# Altium schematic sheet Robot Omini.SchDoc
size A4; SheetNumber: 1; SheetTotal: 1
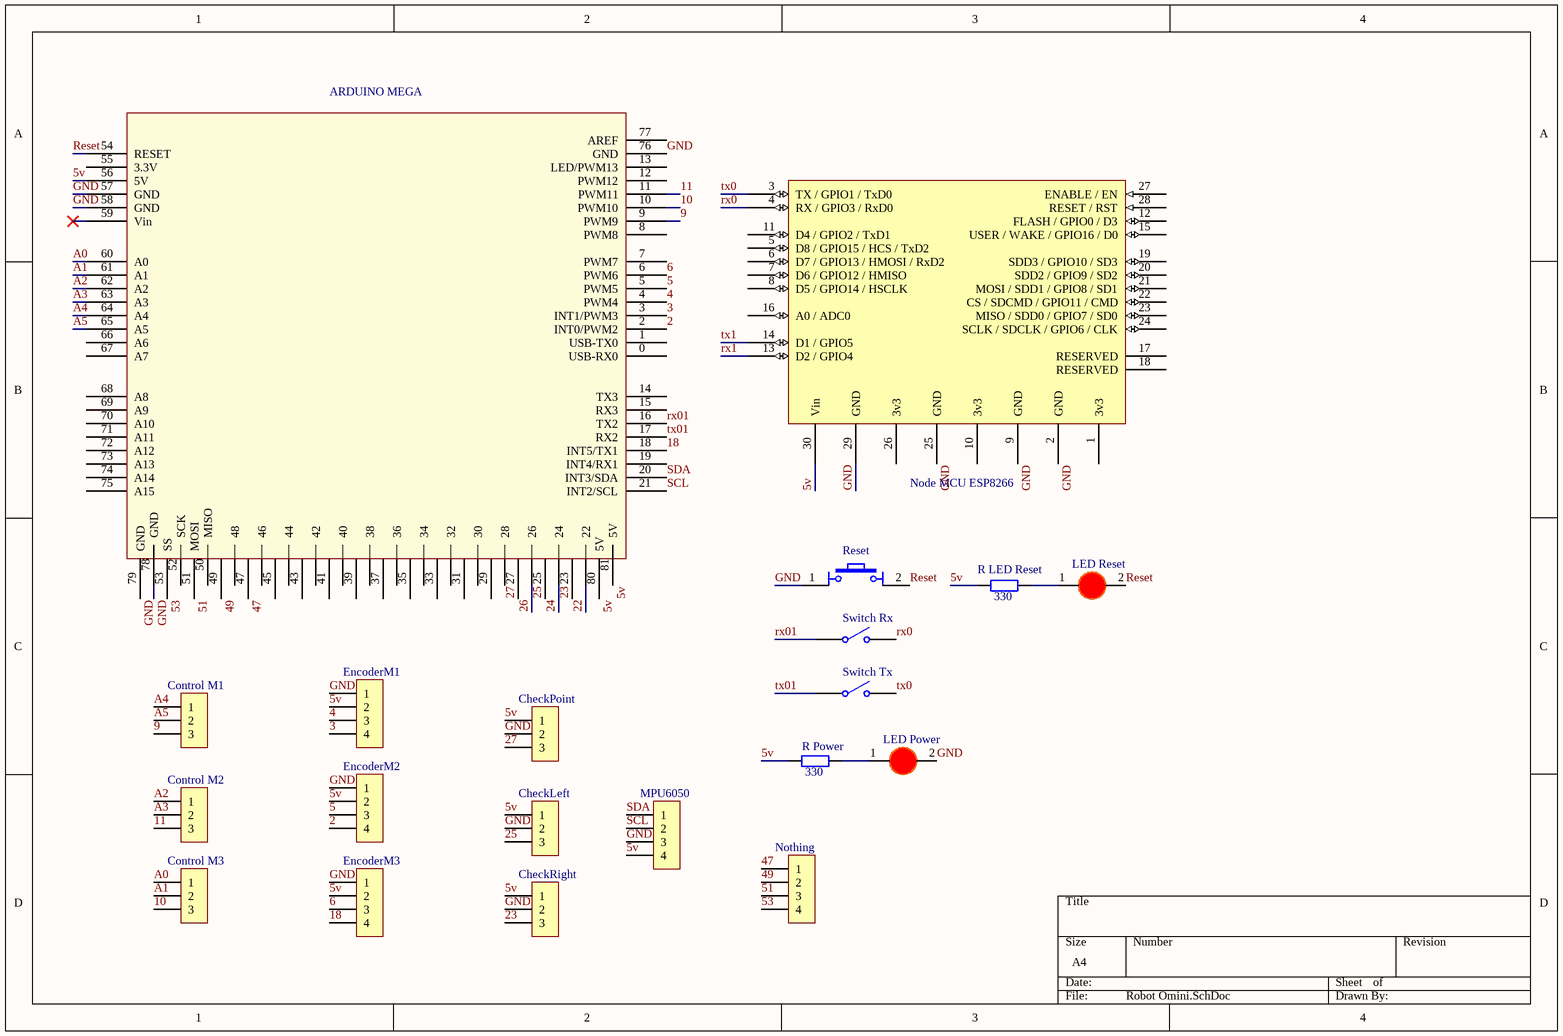
[diagram p0: Robot Omini.SchDoc]

## Parts
Arduino_Mega  ARDUINO MEGA  [ARDUINO MEGA]
CheckLeft  (no value)  [Header DT 3P_2.54]
CheckPoint  (no value)  [Header DT 3P_2.54]
CheckRight  (no value)  [Header DT 3P_2.54]
Control_M1  (no value)  [Header DT 3P_2.54]
Control_M2  (no value)  [Header DT 3P_2.54]
Control_M3  (no value)  [Header DT 3P_2.54]
EncoderM1  Header 4P 2.54 Duc Thang  [Header DT 4P_2.54]  (value not drawn)
EncoderM2  Header 4P 2.54 Duc Thang  [Header DT 4P_2.54]  (value not drawn)
EncoderM3  Header 4P 2.54 Duc Thang  [Header DT 4P_2.54]  (value not drawn)
LED_Power  LED 3mm  [LED-3MM-RED]  (value not drawn)
LED_Reset  LED 3mm  [LED-3MM-RED]  (value not drawn)
MPU6050  Header 4P 2.54 Duc Thang  [Header DT 4P_2.54]  (value not drawn)
NodeMCU  Node MCU ESP8266  [NodeMCU DevKit v1.0 - Inside Labels]
Nothing  Header 4P 2.54 Duc Thang  [Header DT 4P_2.54]  (value not drawn)
R_LED_Reset  330  [tro vach 1/4w]
R_Power  330  [tro vach 1/4w]
Reset  Nut Nhan 4 Chan Cam 6x6  [Nut Nhan 4 Chan Cam 6x6]  (value not drawn)
Switch_Rx  SW-SPST  [SPST-2]  (value not drawn)
Switch_Tx  SW-SPST  [SPST-2]  (value not drawn)

## Nets
2: Arduino_Mega.2(INT0/PWM2) EncoderM2.4
3: Arduino_Mega.3(INT1/PWM3) EncoderM1.4
4: Arduino_Mega.4(PWM4) EncoderM1.3
5: Arduino_Mega.5(PWM5) EncoderM2.3
5v: Arduino_Mega.56(5V) Arduino_Mega.80(5V) Arduino_Mega.81(5V) CheckLeft.1 CheckPoint.1 CheckRight.1 EncoderM1.2 EncoderM2.2 EncoderM3.2 MPU6050.4 NodeMCU.30(Vin) R_LED_Reset.1 R_Power.1
6: Arduino_Mega.6(PWM6) EncoderM3.3
9: Arduino_Mega.9(PWM9) Control_M1.3
10: Arduino_Mega.10(PWM10) Control_M3.3
11: Arduino_Mega.11(PWM11) Control_M2.3
18: Arduino_Mega.18(INT5/TX1) EncoderM3.4
22: Arduino_Mega.22
23: Arduino_Mega.23 CheckRight.3
24: Arduino_Mega.24
25: Arduino_Mega.25 CheckLeft.3
26: Arduino_Mega.26
27: Arduino_Mega.27 CheckPoint.3
47: Arduino_Mega.47 Nothing.1
49: Arduino_Mega.49 Nothing.2
51: Arduino_Mega.51(MOSI) Nothing.3
53: Arduino_Mega.53(SS) Nothing.4
A0: Arduino_Mega.60(A0) Control_M3.1
A1: Arduino_Mega.61(A1) Control_M3.2
A2: Arduino_Mega.62(A2) Control_M2.1
A3: Arduino_Mega.63(A3) Control_M2.2
A4: Arduino_Mega.64(A4) Control_M1.1
A5: Arduino_Mega.65(A5) Control_M1.2
GND: Arduino_Mega.57(GND) Arduino_Mega.58(GND) Arduino_Mega.76(GND) Arduino_Mega.78(GND) Arduino_Mega.79(GND) CheckLeft.2 CheckPoint.2 CheckRight.2 EncoderM1.1 EncoderM2.1 EncoderM3.1 LED_Power.2(K) MPU6050.3 NodeMCU.2(GND) NodeMCU.9(GND) NodeMCU.25(GND) NodeMCU.29(GND) Reset.1
Reset: Arduino_Mega.54(RESET) LED_Reset.2(K) Reset.2
rx0: NodeMCU.4(RX_/_GPIO3_/_RxD0) Switch_Rx.2(NO)
rx1: NodeMCU.13(D2_/_GPIO4)
rx01: Arduino_Mega.16(TX2) Switch_Rx.1(COMMON)
SCL: Arduino_Mega.21(INT2/SCL) MPU6050.2
SDA: Arduino_Mega.20(INT3/SDA) MPU6050.1
tx0: NodeMCU.3(TX_/_GPIO1_/_TxD0) Switch_Tx.2(NO)
tx1: NodeMCU.14(D1_/_GPIO5)
tx01: Arduino_Mega.17(RX2) Switch_Tx.1(COMMON)
NetLED_Power_1: LED_Power.1(A) R_Power.2
NetLED_Reset_1: LED_Reset.1(A) R_LED_Reset.2

Not connected (* = marked no-connect by the designer): Arduino_Mega 0(USB-RX0) 1(USB-TX0) 7(PWM7) 8(PWM8) 12(PWM12) 13(LED/PWM13) 14(TX3) 15(RX3) 19(INT4/RX1) 28 29 30 31 32 33 34 35 36 37 38 39 40 41 42 43 44 45 46 48 50(MISO) 52(SCK) 55(3.3V) 59(Vin)* 66(A6) 67(A7) 68(A8) 69(A9) 70(A10) 71(A11) 72(A12) 73(A13) 74(A14) 75(A15) 77(AREF); NodeMCU 1(3v3) 5(D8_/_GPIO15_/_HCS_/_TxD2) 6(D7_/_GPIO13_/_HMOSI_/_RxD2) 7(D6_/_GPIO12_/_HMISO) 8(D5_/_GPIO14_/_HSCLK) 10(3v3) 11(D4_/_GPIO2_/_TxD1) 12(FLASH_/_GPIO0_/_D3) 15(USER_/_WAKE_/_GPIO16_/_D0) 16(A0_/_ADC0) 17(RESERVED) 18(RESERVED) 19(SDD3_/_GPIO10_/_SD3) 20(SDD2_/_GPIO9_/_SD2) 21(MOSI_/_SDD1_/_GPIO8_/_SD1) 22(CS_/_SDCMD_/_GPIO11_/_CMD) 23(MISO_/_SDD0_/_GPIO7_/_SD0) 24(SCLK_/_SDCLK_/_GPIO6_/_CLK) 26(3v3) 27(ENABLE_/_EN) 28(RESET_/_RST)

## Library data of the parts
CheckLeft CheckPoint CheckRight Control_M1-Control_M3 = Header 3P 2.54 Duc Thang: Cắm; Ten_Linh_Kien: Header 3P XH2.54-3P Đực Thẳng; Don_Vi: Con; Ma_Hang: MH001292; Chung_Loai: Cắm
EncoderM1-EncoderM3 MPU6050 Nothing = Header 4P 2.54 Duc Thang: Cắm; Ten_Linh_Kien: Header 4P XH2.54-4P Đực Thẳng; Don_Vi: Con; Ma_Hang: MH001285; Chung_Loai: Cắm
LED_Power LED_Reset = LED 3mm Do: Cắm; Don_Vi: Con; Ma_Hang: MH003892; Ten_Linh_Kien: Led 3MM Phủ Đỏ (10c); Ghi_Chu: *; Kieu_Chan: *; Chung_Loai: Cắm
NodeMCU = NodeMCU DevKit v1.0
R_LED_Reset R_Power = Tro Vach 1/4W 5% 510R: Cắm; So_Chan: 2; Don_Vi: Con; Ten_Linh_Kien: Trở Vạch 1/4w 5% 510R; Ma_Hang: MH007325; Chung_Loai: Cắm; Kieu_Chan: *
Reset = Nut Nhan 4 Chan Cam 6x6: Nut Nhan 4 Chan 6x6mm; Ten: Nút Nhấn 4 Chân 6x6x5MM DIP; Ma_Hang: MH004584
Switch_Rx Switch_Tx = SW-SPST: Single-Pole, Single-Throw Switch; Published: 24-Mar-1999; LatestRevisionDate: 17-Jul-2002; LatestRevisionNote: Re-released for DXP Platform.; PackageReference: SPST-2; Publisher: Altium Limited; PackageDescription: Switch; 2 Leads